# EAGLE schematic tmc-260-shield (EAGLE 6.3)
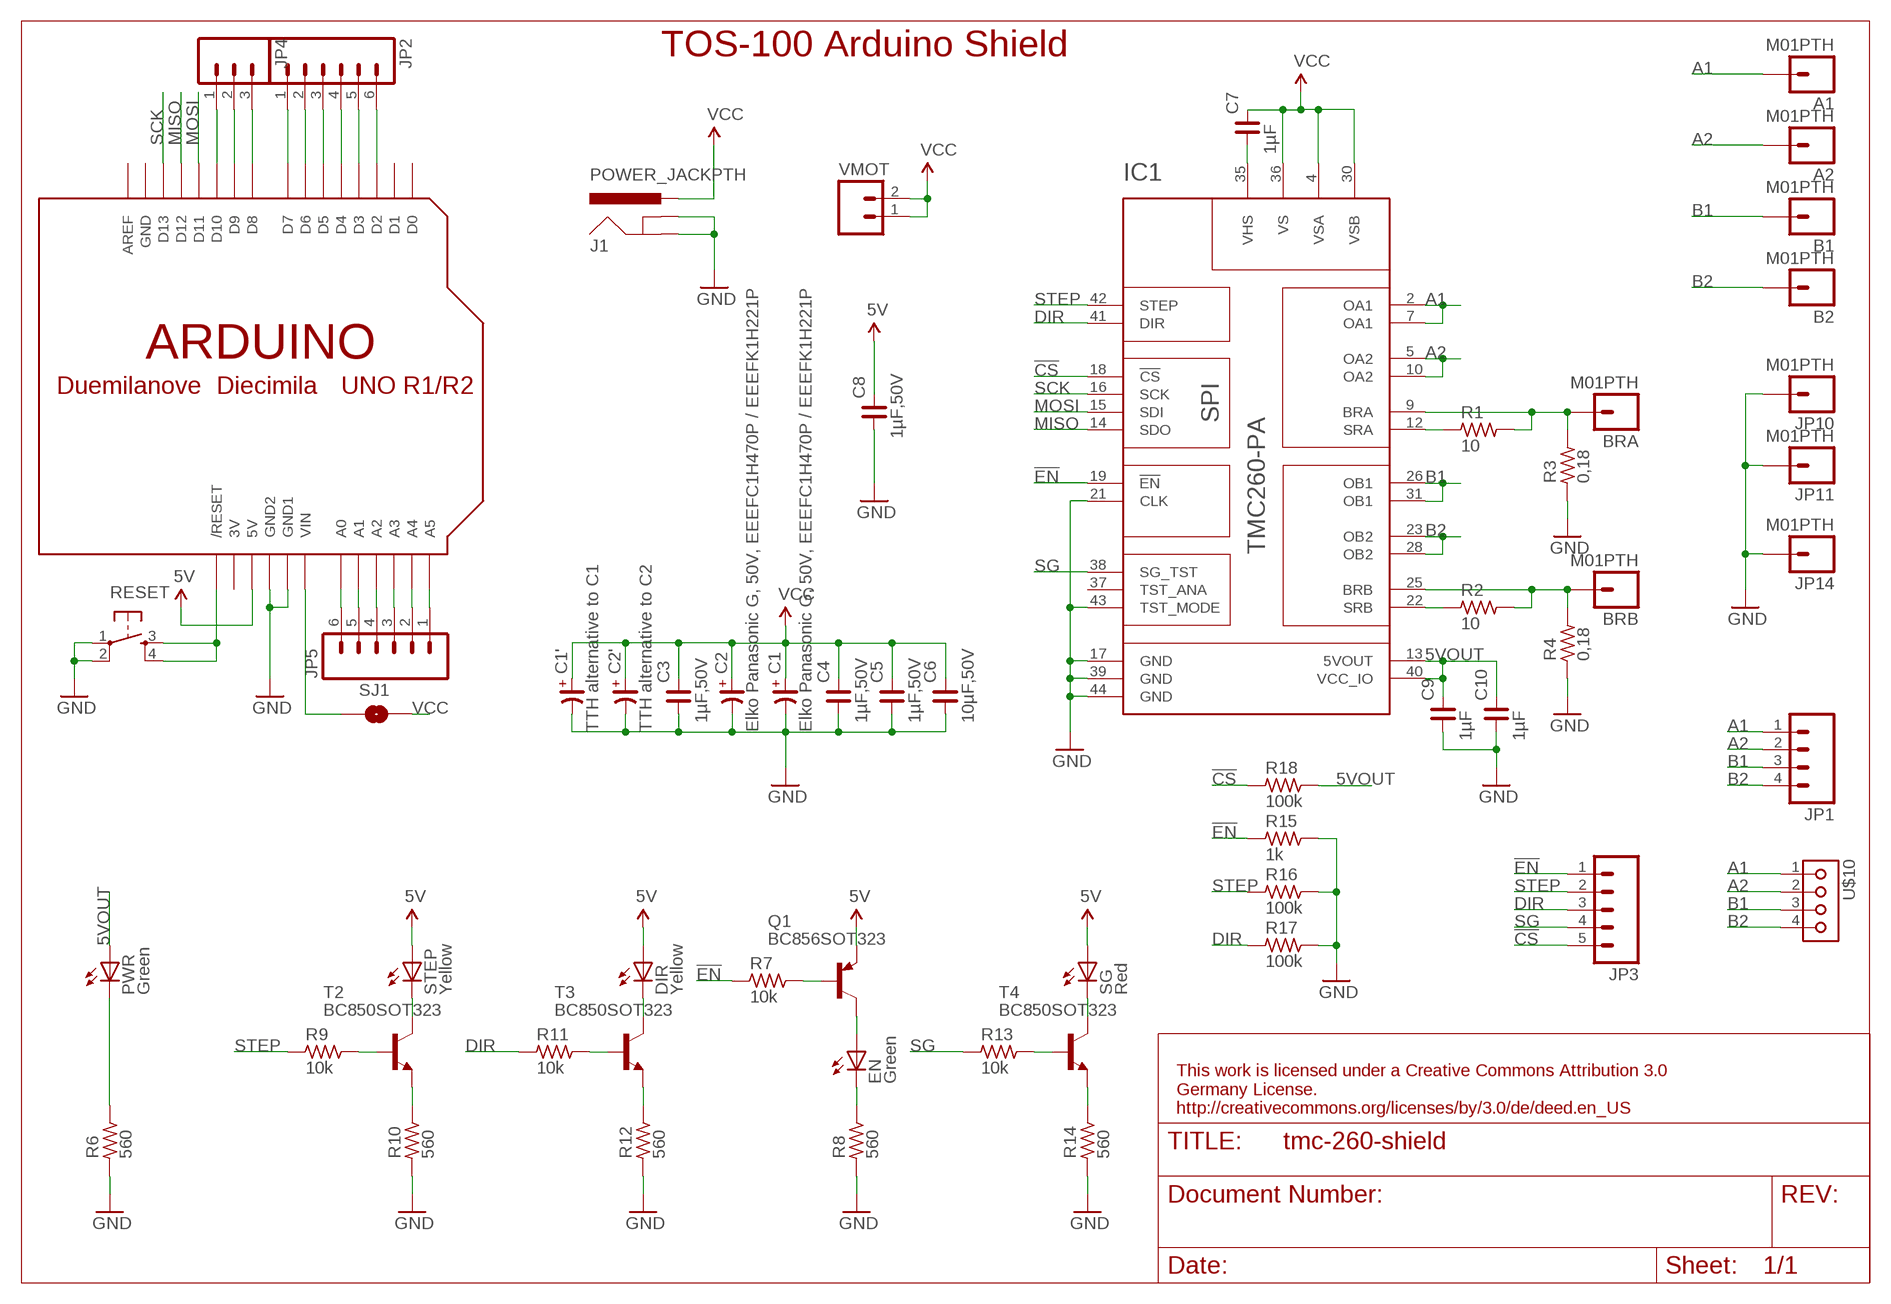
[diagram p0: schematic, sheet 1]

## Parts
A1  M01PTH  [1X01]
A2  M01PTH  [1X01]
B1  M01PTH  [1X01]
B2  M01PTH  [1X01]
BRA  M01PTH  [1X01]
BRB  M01PTH  [1X01]
C1  Elko Panasonic G, 50V, EEEFC1H470P / EEEFK1H221P  CP_SV-G  [CSV-G]
C1'  TTH alternative to C1  CP_E-035X100  [CE-035X100]
C2  Elko Panasonic G, 50V, EEEFC1H470P / EEEFK1H221P  CP_SV-G  [CSV-G]
C2'  TTH alternative to C2  CP_E-035X100  [CE-035X100]
C3  1µF,50V  C_0603  [C0603]
C4  1µF,50V  C_0603  [C0603]
C5  1µF,50V  C_0603  [C0603]
C6  10µF,50V  C_1206  [C1206]
C7  1µF  C_0603  [C0603]
C8  1µF,50V  C_0603  [C0603]
C9  1µF  C_0603  [C0603]
C10  1µF  C_0603  [C0603]
DIR  Yellow  LEDMICRO-SIDELED  [MICRO-SIDELED]
EN  Green  LEDMICRO-SIDELED  [MICRO-SIDELED]
IC1  TMC260-PA  [PQFP44_WITH_PADS]
J1  POWER_JACKPTH  [POWER_JACK_PTH]
JP1  M04SCREW  [SCREWTERMINAL-3.5MM-4]
JP2  M06SIP  [1X06]
JP3  M05PTH  [1X05]
JP4  M03PTH  [1X03]
JP5  M06SIP  [1X06]
JP10  M01PTH  [1X01]
JP11  M01PTH  [1X01]
JP14  M01PTH  [1X01]
PWR  Green  LEDMICRO-SIDELED  [MICRO-SIDELED]
Q1  BC856SOT323  BC858SOT323  [SOT323-BEC]
R1  10  R_0603  [R0603]
R2  10  R_0603  [R0603]
R3  0,18  R_2512  [R2512]
R4  0,18  R_2512  [R2512]
R6  560  R_0603  [R0603]
R7  10k  R_0603  [R0603]
R8  560  R_0603  [R0603]
R9  10k  R_0603  [R0603]
R10  560  R_0603  [R0603]
R11  10k  R_0603  [R0603]
R12  560  R_0603  [R0603]
R13  10k  R_0603  [R0603]
R14  560  R_0603  [R0603]
R15  1k  R_0603  [R0603]
R16  100k  R_0603  [R0603]
R17  100k  R_0603  [R0603]
R18  100k  R_0603  [R0603]
RESET  TAC_SWITCHSMD  [TACTILE_SWITCH_SMD]
SG  Red  LEDMICRO-SIDELED  [MICRO-SIDELED]
SJ1  SOLDERJUMPERNO  [SJ_2S-NO]
STEP  Yellow  LEDMICRO-SIDELED  [MICRO-SIDELED]
T2  BC850SOT323  [SOT323-BEC]
T3  BC850SOT323  [SOT323-BEC]
T4  BC850SOT323  [SOT323-BEC]
U$1  ARDUINOUNO  [ARDUINO]
U$10  KK4H  [KK-H-4]
VMOT  M021X02_NO_SILK  [1X02_NO_SILK]

## Nets
5V: C8.2 DIR.A Q1.E SG.A STEP.A U$1.5V
5VOUT: C9.2 C10.2 IC1.13(5VOUT) IC1.40(VCC_IO) PWR.A R18.2
!CS: IC1.18(!CS) JP3.5 R18.1
!EN: IC1.19(!EN) JP3.1 R7.1 R15.1
A1: A1.1 IC1.2(OA1) IC1.7(OA1) JP1.1 U$10.1
A2: A2.1 IC1.5(OA2) IC1.10(OA2) JP1.2 U$10.2
B1: B1.1 IC1.26(OB1) IC1.31(OB1) JP1.3 U$10.3
B2: B2.1 IC1.23(OB2) IC1.28(OB2) JP1.4 U$10.4
DIR: IC1.41(DIR) JP3.3 R11.1 R17.1
GND: C1'.- C1.- C2'.- C2.- C3.1 C4.1 C5.1 C6.1 C8.1 C9.1 C10.1 IC1.17(GND) IC1.21(CLK) IC1.39(GND) IC1.43(TST_MODE) IC1.44(GND) J1.GND J1.GNDBREAK JP10.1 JP11.1 JP14.1 R3.1 R4.1 R6.1 R8.1 R10.1 R12.1 R14.1 R15.2 R16.2 R17.2 RESET.1 RESET.2 U$1.GND1 U$1.GND2
MISO: IC1.14(SDO) U$1.D12
MOSI: IC1.15(SDI) U$1.D11
N$1: JP4.1 U$1.D10
N$2: JP4.2 U$1.D9
N$3: JP4.3 U$1.D8
N$4: JP2.1 U$1.D7
N$5: JP2.2 U$1.D6
N$6: JP2.3 U$1.D5
N$7: JP2.4 U$1.D4
N$8: JP2.5 U$1.D3
N$9: JP2.6 U$1.D2
N$10: JP5.1 U$1.A5
N$11: JP5.2 U$1.A4
N$12: JP5.3 U$1.A3
N$13: JP5.4 U$1.A2
N$14: JP5.5 U$1.A1
N$15: JP5.6 U$1.A0
N$16: R9.2 T2.B
N$17: RESET.3 RESET.4 U$1.RESET(/RESET)
N$18: SJ1.1 U$1.VIN
N$19: STEP.C T2.C
N$20: R10.2 T2.E
N$21: PWR.C R6.2
N$24: R11.2 T3.B
N$25: DIR.C T3.C
N$26: R12.2 T3.E
N$27: EN.A Q1.C
N$28: BRA.1 IC1.9(BRA) R1.2 R3.2
N$29: IC1.12(SRA) R1.1
N$30: BRB.1 IC1.25(BRB) R2.2 R4.2
N$31: IC1.22(SRB) R2.1
N$35: EN.C R8.2
N$36: Q1.B R7.2
N$38: R13.2 T4.B
N$39: SG.C T4.C
N$40: R14.2 T4.E
SCK: IC1.16(SCK) U$1.D13
SG: IC1.38(SG_TST) JP3.4 R13.1
STEP: IC1.42(STEP) JP3.2 R9.1 R16.1
VCC: C1'.+ C1.+ C2'.+ C2.+ C3.2 C4.2 C5.2 C6.2 C7.2 IC1.4(VSA) IC1.30(VSB) IC1.36(VS) J1.PWR SJ1.2 VMOT.1 VMOT.2
VHS: C7.1 IC1.35(VHS)
Unconnected: IC1.37(TST_ANA) U$1.AREF U$1.D0 U$1.D1

## Notes on the sheet
- TOS-100 Arduino Shield
- This work is licensed under a Creative Commons Attribution 3.0 
  Germany License.
  http://creativecommons.org/licenses/by/3.0/de/deed.en_US

## Power pins joined to a net without a drawn wire
3V: U$1.3V
GND: U$1.GND

## Library data of the parts
A1 A2 B1 B2 BRA BRB JP10 JP11 JP14 = SparkFun:M01: Header 1 Standard 1-pin 0.1" header. Use with straight break away headers (SKU : PRT-00116), right angle break away headers (PRT-00553), swiss pins (PRT-00743), machine pins (PRT-00117), and female headers (PRT-00115).
C1 C1' C2 C2' = rc-master:CP_: POLARIZED CAP
C3-C10 = rc-master-smd:C_: NON-POLARIZED CAP
DIR EN PWR SG STEP = LED:LED: LED OSRAM: - CHIPLED LG R971, LG N971, LY N971, LG Q971, LY Q971, LO R971, LY R971 LH N974, LH R974 LS Q976, LO Q976, LY Q976 LO Q996 - Hyper CHIPLED LW Q18S LB Q993, LB Q99A, LB R99A - SideLED LS A670, LO A670, LY A670, LG A670, LP A670 LB A673, LV A673, LT A673, LW A673 LH A674 LY A675 LS A676, LA A676, LO A676, LY A676, LW A676 LS A679, LY A679, LG A679 - Hyper Micro SIDELED® LS Y876, LA Y876, LO Y876, LY Y876 LT Y87S - SmartLED LW L88C, LW L88S LB L89C, LB L89S, LG L890 LS L89K, LO L89K, LY L89K LS L896, LA L896, LO L896, LY L896 - TOPLED LS T670, LO T670, LY T670, LG T670, LP T670 LSG T670, LSP T670, LSY T670, LOP T670, LYG T670 LG T671, LOG T671, LSG T671 LB T673, LV T673, LT T673, LW T673 LH T674 LS T676, LA T676, LO T676, LY T676, LB T676, LH T676, LSB T676, LW T676 LB T67C, LV T67C, LT T67C, LS T67K, LO T67K, LY T67K, LW E67C LS E67B, LA E67B, LO E67B, LY E67B, LB E67C, LV E67C, LT E67C LW T67C LS T679, LY T679, LG T679 LS T770, LO T770, LY T770, LG T770, LP T770 LB T773, LV T773, LT T773, LW T773 LH T774 LS E675, LA E675, LY E675, LS T675 LS T776, LA T776, LO T776, LY T776, LB T776 LHGB T686 LT T68C, LB T68C - Hyper Mini TOPLED® LB M676 - Mini TOPLED Santana® LG M470 LS M47K, LO M47K, LY M47K Source: http://www.osram.convergy.de LUXEON: - LUMILED® LXK2-PW12-R00, LXK2-PW12-S00, LXK2-PW14-U00, LXK2-PW14-V00 LXK2-PM12-R00, LXK2-PM12-S00, LXK2-PM14-U00 LXK2-PE12-Q00, LXK2-PE12-R00, LXK2-PE12-S00, LXK2-PE14-T00, LXK2-PE14-U00 LXK2-PB12-K00, LXK2-PB12-L00, LXK2-PB12-M00, LXK2-PB14-N00, LXK2-PB14-P00, LXK2-PB14-Q00 LXK2-PR12-L00, LXK2-PR12-M00, LXK2-PR14-Q00, LXK2-PR14-R00 LXK2-PD12-Q00, LXK2-PD12-R00, LXK2-PD12-S00 LXK2-PH12-R00, LXK2-PH12-S00 LXK2-PL12-P00, LXK2-PL12-Q00, LXK2-PL12-R00 Source: www.luxeon.com KINGBRIGHT: KA-3528ASYC Source: www.kingbright.com
IC1 = trinamic-2:TMC260-PA: TRINAMIC Energy Efficient Microstep Driver for up to 1.7A with coolStep™ Information given in this library is believed to be accurate and reliable. However no warranty is given for its correctness. Datasheet for TMC260/261/262 <http://www.trinamic.com/tmc/media/Downloads/integrated_circuits/TMC262/TMC260_TMC261_TMC262_datasheet.pdf> Description Energy Efficient Microstep Driver for up to 1.7A with coolStep™ The TMC260 is the first energy efficient high precision microstepping driver IC for bipolar stepper motors with integrated power MOSFETs. The unique high resolution sensorless load detection stallGuard2™ is used to for the world™s first integrated load dependent current control feature called coolStep™. The ability to read out the load and detect an overload makes the TMC260 an optimum choice for drives where a high reliability is desired at a low cost. The new patented spreadCycle PWM mixed decay chopper scheme ensures best zero crossing performance as well as high speed operation. The TMC260 can be driven with Step & Direction signals as well as by serial SPI™ interface. Using the microPlyer allows to operate the motor with highest 256 ™Step smoothness reducing the input frequency to 16 ™Steps. A full set of protection and diagnostic features makes this device very rugged. It directly drives stepper motors with up to 1.7A. This way it reaches highest energy efficiency and allows driving of a high motor current without cooling measures even at high environment temperatures. Specifications Main characteristics 2-phase bipolar stepper motor driver stallGuard2™ sensorless load detection coolStep™ load dependent current control save up to 80% energy spreadCycle hysteresis PWM chopper best current zero crossing performance best sine wave form 256 ™Steps/fullstep (51200 pos/rev.) with a standard 200 step motor microPlyer 16-to-256 ™Step multiplyer full protection and diagnostics lowest power dissipation programmable slope control for low EME standby and shutdown mode stall / load detection output Low power consumption via low RDS-ON power stage Interface Step & Direction easy-to-use SPI™ (20bit) Electrical Data up to 1.7A coil current (peak) 9V to 40V motor supply 3.3V or 5V operation for digital part Package TQFP44 10x10 mm² package RoHS compliant
J1 = SparkFun:POWER_JACK: Power Jack This is the standard 5.5mm barrel jack for power. The PTH is the most common, proven, reliable, footprint. All others are experimental. The Slot footprint only works if the mill layer is transmitted to the PCB fab house so be warned. Spark Fun Electronics SKU : PRT-00119. Mating wall wart : TOL-00298 (and others)
JP1 = SparkFun:M04: Header 4 Standard 4-pin 0.1" header. Use with straight break away headers (SKU : PRT-00116), right angle break away headers (PRT-00553), swiss pins (PRT-00743), machine pins (PRT-00117), and female headers (PRT-00115). Molex polarized connector foot print use with SKU : PRT-08231 with associated crimp pins and housings.
JP2 JP5 = SparkFun:M06: Header 6 Standard 6-pin 0.1" header. Use with straight break away headers (SKU : PRT-00116), right angle break away headers (PRT-00553), swiss pins (PRT-00743), machine pins (PRT-00117), and female headers (PRT-00115). Molex polarized connector foot print use with SKU : PRT-08094 with associated crimp pins and housings. NOTES ON THE VARIANTS LOCK and LOCK_LONGPADS... This footprint was designed to help hold the alignment of a through-hole component (i.e. 6-pin header) while soldering it into place. You may notice that each hole has been shifted either up or down by 0.005 of an inch from it's more standard position (which is a perfectly straight line). This slight alteration caused the pins (the squares in the middle) to touch the edges of the holes. Because they are alternating, it causes a "brace" to hold the component in place. 0.005 has proven to be the perfect amount of "off-center" position when using our standard breakaway headers. Although looks a little odd when you look at the bare footprint, once you have a header in there, the alteration is very hard to notice. Also, if you push a header all the way into place, it is covered up entirely on the bottom side. This idea of altering the position of holes to aid alignment will be further integrated into the Sparkfun Library for other footprints. It can help hold any component with 3 or more connection pins.
JP3 = SparkFun:M05: Header 5 Standard 5-pin 0.1" header. Use with straight break away headers (SKU : PRT-00116), right angle break away headers (PRT-00553), swiss pins (PRT-00743), machine pins (PRT-00117), and female headers (PRT-00115). Molex polarized connector foot print use with SKU : PRT-08230 with associated crimp pins and housings.
JP4 = SparkFun:M03: Header 3 Standard 3-pin 0.1" header. Use with straight break away headers (SKU : PRT-00116), right angle break away headers (PRT-00553), swiss pins (PRT-00743), machine pins (PRT-00117), and female headers (PRT-00115). Molex polarized connector foot print use with SKU : PRT-08232 with associated crimp pins and housings.
Q1 = additional:BC858*: PNP Transistror
R1-R4 R6-R18 = rc-master-smd:R_: RESISTOR
RESET = SparkFun:TAC_SWITCH: Momentary Switch Button commonly used for reset or general input. Spark Fun Electronics SKU : COM-00097
SJ1 = SparkFun:SOLDERJUMPER: Solder Jumper Standard SMD solder jumper. Used to automate production. Two varients : Normally Open and Normally Closed are the same, but have different paste layers. NC will have a large amount of paste and should jumper during reflow.
T2-T4 = additional:BC850: NPN TRANSISTOR
U$1 = adafruit:ARDUINO: Arduino Diecimila/Duemilanove Make a shield with ease, this package has all the named pins as well as the two mounting drill holes and an outline of the USB and DC power connector. The outline is on the DIMENSION layer, so if your board house uses it they will cut the outline to match. http://www.ladyada.net/library/pcb/eaglelibrary.html
U$10 = molex-kk:KK4*
VMOT = SparkFun:M02: Header 2 Standard 2-pin 0.1" header. Use with straight break away headers (SKU : PRT-00116), right angle break away headers (PRT-00553), swiss pins (PRT-00743), machine pins (PRT-00117), and female headers (PRT-00115). Molex polarized connector foot print use with SKU : PRT-08233 with associated crimp pins and housings.